# Altium schematic sheet LO 2.SchDoc
size A4; SheetNumber: 9; SheetTotal: 12
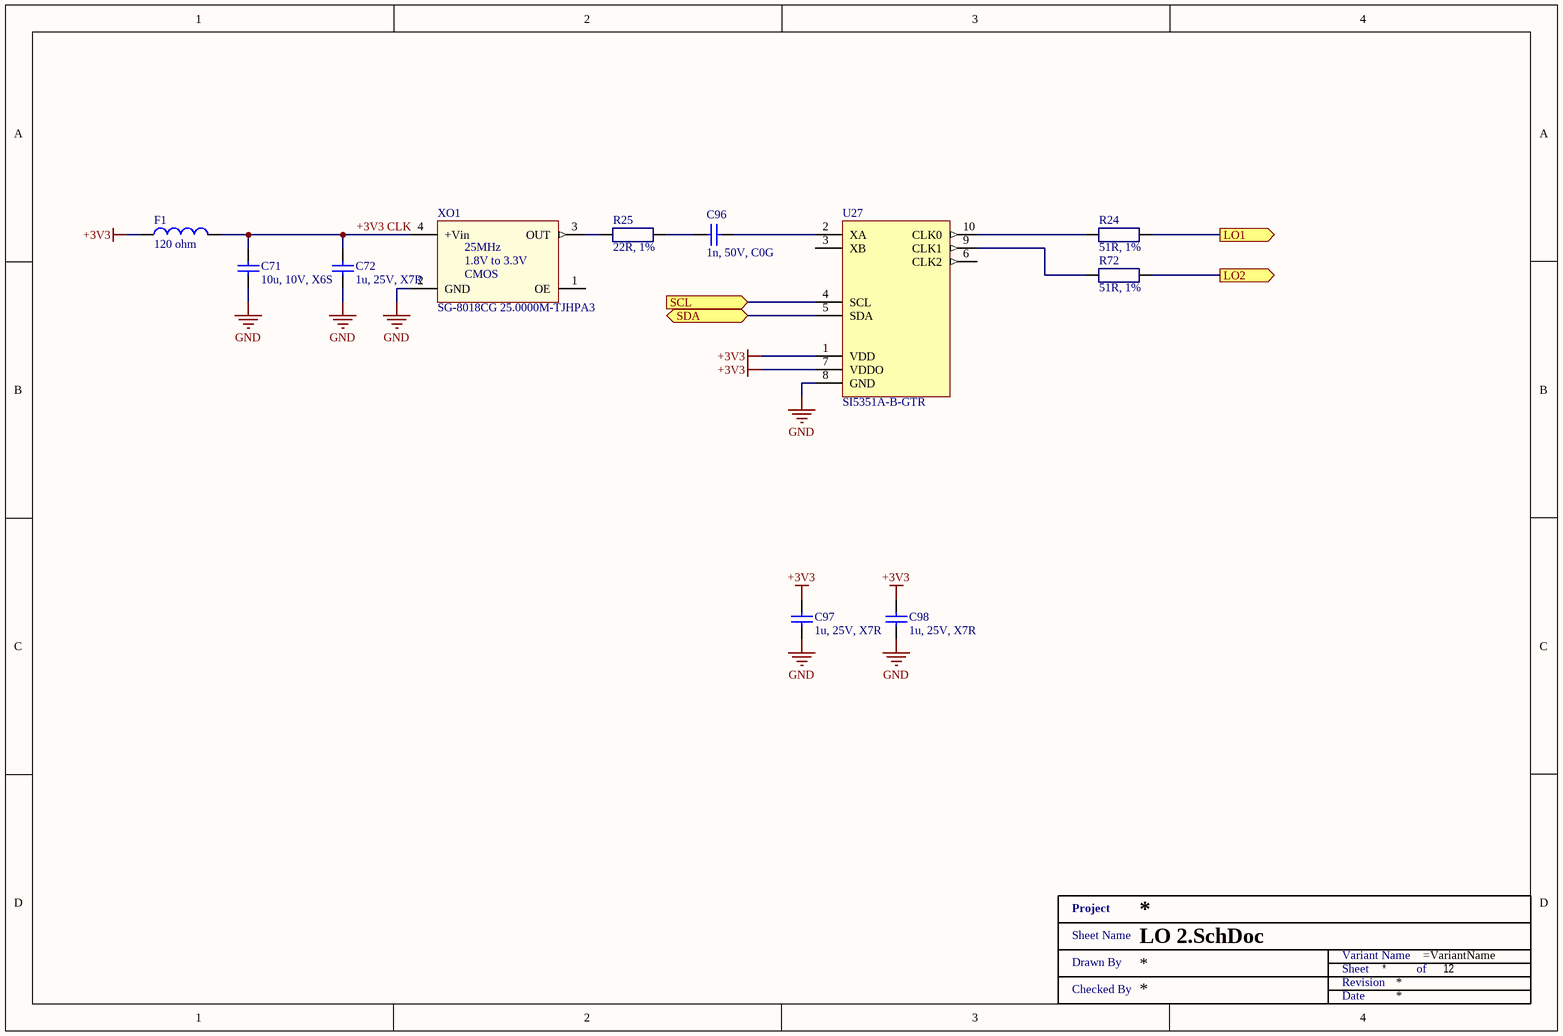
[diagram p0: LO 2.SchDoc]

## Parts
C71  10u, 10V, X6S  [SMD0603]
C72  1u, 25V, X7R  [SMD0603]
C96  1n, 50V, C0G  [SMD0603]
C97  1u, 25V, X7R  [SMD0603]
C98  1u, 25V, X7R  [SMD0603]
F1  120 ohm  [SMD0805 - R]
R24  51R, 1%  [SMD0603 - R]
R25  22R, 1%  [SMD0603 - R]
R72  51R, 1%  [SMD0603 - R]
U27  SI5351A-B-GTR  [MSOP-10]
XO1  SG-8018CG 25.0000M-TJHPA3  [XO 2.5x2.0mm]
XX?  Title 1  (value not drawn)  (graphical)

## Ports
LO1 (out), LO2 (out), SCL (in), SDA (bidir)

## Nets
+3V3: C97.2 C98.2 F1.2 U27.1(VDD) U27.7(VDDO)
GND: C71.1 C72.1 C97.1 C98.1 U27.8(GND) XO1.2(GND)
+3V3 CLK: C71.2 C72.2 F1.1 XO1.4(+Vin)
LO1: R24.2 ; port LO1
LO2: R72.2 ; port LO2
SCL: U27.4(SCL) ; port SCL
SDA: U27.5(SDA) ; port SDA
NetC96_1: C96.1 R25.2
NetC96_2: C96.2 U27.2(XA)
NetR24_1: R24.1 U27.10(CLK0)
NetR25_1: R25.1 XO1.3(OUT)
NetR72_1: R72.1 U27.9(CLK1)

Not connected (* = marked no-connect by the designer): U27 3(XB) 6(CLK2); XO1 1(OE)

## Notes on the sheet
- (in symbol SG-8018CG 25.0000M-TJHPA3) 1.8V to 3.3V; CMOS
- (in symbol Title 1) Project; Sheet Name; Variant Name; Drawn By; Sheet; of; Revision; Checked By; Date

## Library data of the parts
C71 = GRT188C81A106ME13D: Cap Ceramic 10uF 10V X6S 20% Pad SMD 0603 105C Automotive T/R; Manufacturer: Murata; Supplier 1: Mouser; Supplier Part Number 1: 81-GRT188C81A106ME3D; Manufacturer Part Number: GRT188C81A106ME13D; RoHS: No; Category: Ceramic Capacitors; Stock 1: 1862; Pricing 1: 1=0.41000, 10=0.20100, 50=0.20100, 100=0.17200, 1000=0.10900, 10000=0.09700 (USD); Mount: Surface Mount; Case/Package: 0603; Case Code (Metric): 1608; Case Code (Imperial): 0603; Min Operating Temperature: -55°C; Max Operating Temperature: 105°C; Packaging: Tape and Reel; Capacitance: 10uF; Voltage Rating: 10V; Tolerance: 20%; Length: 0.063inch; Width: 0.031inch; Thickness: 0.035inch; Ratings: AEC-Q200; ComponentLink1URL: http://search.murata.co.jp/Ceramy/image/img/A01X/G101/ENG/GRT188C81A106ME13-01.pdf?src-supplier=Digi-Key; ComponentLink1Description: http://search.murata.co.jp/Ceramy/image/img/A01X/G101/ENG/GRT188C81A106ME13-01.pdf?src-supplier=Digi-Key; Supplier 2: Farnell; Supplier Part Number 2: 3582904; Supplier 3: Digi-Key; Supplier Part Number 3: 490-12283-6-ND
C72 C97 C98 = CGA3E1X7R1E105K080AC: CAP CER 1UF 25V X7R 0603; Manufacturer: TDK Corporation; Tolerance: ±10%; Manufacturer Part Number: CGA3E1X7R1E105K080AC; RoHS: RoHS Compliant; Category: Capacitors; Stock 1: 109509; Pricing 1: 1=0.2, 10=0.135, 100=0.0686, 500=0.04696, 1000=0.04154 (USD); Packaging: Cut Tape (CT); Part Status: Active; Voltage - Rated: 25V; Temperature Coefficient: X7R; Operating Temperature: -55°C ~ 125°C; Features: -; Ratings: AEC-Q200; Applications: Automotive; Failure Rate: -; Mounting Type: Surface Mount, MLCC; Package / Case: 0603 (1608 Metric); Size / Dimension: 0.063" L x 0.032" W (1.60mm x 0.80mm); Height - Seated (Max): -; Thickness (Max): 0.035" (0.90mm); Lead Spacing: -; Lead Style: -; ComponentLink1URL: https://product.tdk.com/info/en/catalog/datasheets/mlcc_automotive_general_en.pdf; ComponentLink1Description: https://product.tdk.com/info/en/catalog/datasheets/mlcc_automotive_general_en.pdf; Capacitance: 1u; Supplier Part Number 2: 2346962
  C72: Supplier 1: Mouser; Supplier Part Number 1: 810-CGA3E1X7R1E105K; Supplier 2: Farnell; Supplier 3: Digi-Key; Supplier Part Number 3: 445-6931-1-ND
  C97 C98: Supplier 1: Digi-Key; Supplier Part Number 1: 445-6931-1-ND; Supplier 2: Mouser; Supplier Part Number 3: 810-CGA3E1X7R1E105K
C96 = MCU0603C102JCT: MULTICOMP - MCU0603C102JCT - CAP, MLCC, C0G/NP0, 1NF, 50V, 0603; Ceramic Capacitor Case: 0603 [1608 Metric]; Voltage Rating: 50; Capacitance Tolerance: ± 5%; Product Range: MCU Series; SVHC: No SVHC (07-Jul-2017); Capacitance Tolerance +: 5%; Capacitor Terminals: SMD; External Depth: 0.8; External Length / Height: 1.6; No. of Pins: 2; Reel Quantity: 4000; Temperature Coefficient: 0ppm/°C ± 30; Voltage Rating V DC: 50V<!--FANDB--><div class="features-and-benefits-container"><div class="features-and-benefits-desc-container"><span class="features-and-benefits-container-desc">SMD Multilayer Ceramic Capacitor, 0603 [1608 Metric], 1000 pF, 50 V, ± 5%, C0G / NP0; Supplier 1: Farnell; Supplier Part Number 1: 9406131; Manufacturer: MULTICOMP; Manufacturer Part Number: MCU0603C102JCT; RoHS: YES; Stock 1: 25831; Pricing 1: 10=0.0164, 100=0.0133, 500=0.0095, 1000=0.0082, 2000=0.0065 (GBP); Capacitance: 1n; Dielectric Characteristic: C0G / NP0; Packaging: Cut Tape; Operating Temperature Min: -55; Operating Temperature Max: 125; Automotive Qualification Standard: -; MSL: -; Capacitance Tolerance ±: ± 5%; External Width: 0.8; Operating Temperature Range: -55°C to +125; Tape Width: 8; Tolerance +: 5%; Tolerance -: 5%; ComponentLink1URL: http://www.farnell.com/datasheets/1723231.pdf; ComponentLink1Description: http://www.farnell.com/datasheets/1723231.pdf
F1 = 742792023: WURTH ELEKTRONIK - 742792023 - FERRITE BEAD, 0.03OHM, 3A, 0805; Impedance @ 100MHz: 120; Ferrite Case Style: 0805 [2012 Metric]; DC Current Rating: 3; DC Resistance Max: 0.03; Impedance Tolerance: ± 25%; Ferrite Mounting: SMD; Resistance: 0.03ohm<!--FANDB--><div class="features-and-benefits-container"><div class="features-and-benefits-description"><span class="features-benefits-value">The 742792023 is a SMD EMI Suppression Ferrite Bead with 0805 case and reliable Ni-Sn electrodes. It can be put directly on the printed circuit board. It offers excellent anti-EMI properties and low DC resistance. Placed very close next to the interference source even with smallest size 0402, maximal impedance at 1000; Manufacturer: WURTH ELEKTRONIK; Manufacturer Part Number: 742792023; RoHS: YES; Stock 1: 4283; Pricing 1: 1=0,123, 50=0,112, 100=0,103, 500=0,0937, 1000=0,0877, 2000=0,0846 (GBP); Product Range: -; Automotive Qualification Standard: -; Packaging: Cut Tape; ComponentLink1URL: http://www.farnell.com/datasheets/1695980.pdf; ComponentLink1Description: http://www.farnell.com/datasheets/1695980.pdf; ComponentLink2URL: http://www.farnell.com/cad/1670054.zip; ComponentLink2Description: http://www.farnell.com/cad/1670054.zip; Supplier 1: Mouser; Supplier Part Number 1: 710-742792023; Supplier 2: Farnell; Supplier Part Number 2: 1635732; Supplier 3: Digi-Key; Supplier Part Number 3: 732-1613-1-ND
R24 R72 = CRCW060351R0FKEA: RES SMD 51 OHM 1% 1/10W 0603; Manufacturer: Vishay Dale; Power (Watts): 0.1W, 1/10W; Temperature Coefficient: ±100ppm/°C; Manufacturer Part Number: CRCW060351R0FKEA; RoHS: RoHS Compliant; Category: Resistors; Stock 1: 21691; Pricing 1: 1=0.1, 10=0.042, 100=0.017, 1000=0.00764, 2500=0.00663 (USD); Packaging: Cut Tape (CT); Part Status: Active; Tolerance: ±1%; Composition: Thick Film; Features: Automotive AEC-Q200; Operating Temperature: -55°C ~ 155°C; Package / Case: 0603 (1608 Metric); Supplier Device Package: 0603; Size / Dimension: 0.063" L x 0.033" W (1.60mm x 0.85mm); Height - Seated (Max): 0.020" (0.50mm); Failure Rate: -; ComponentLink1URL: http://www.vishay.com/docs/20035/dcrcwe3.pdf; ComponentLink1Description: http://www.vishay.com/docs/20035/dcrcwe3.pdf; Resistance: 51R; Supplier 1: Mouser; Supplier Part Number 1: 71-CRCW0603-51-E3; Supplier 2: Farnell; Supplier Part Number 2: 1652889; Supplier 3: Digi-Key; Supplier Part Number 3: 541-51.0HCT-ND
R25 = RC0603FR-0722RL: YAGEO (PHYCOMP) - RC0603FR-0722RL - RES, THICK FILM, 22R, 1%, 0.1W, 0603; Voltage Rating: 50; Resistor Case Style: 0603 [1608 Metric]; Power Rating: 100; Product Range: RC Series; Temperature Coefficient: ± 100; SVHC: No SVHC (20-Jun-2016); External Depth: 0.45; External Length / Height: 1.6; External Width: 0.8; Full Power Rating Temperature: 70; No. of Pins: 2; Reel Quantity: 5000; Resistor Mounting: Surface Mount Device; Voltage Rating V DC: 50V<!--FANDB--><div class="features-and-benefits-container"><div class="features-and-benefits-desc-container"><span class="features-and-benefits-container-desc">SMD Chip Resistor, Thick Film, 22 ohm, 50 V, 0603 [1608 Metric], 100 mW, ± 1%, RC Series</span></div><div class="features-and-benefits-description"><span class="features-benefits-value">The Yageo RC_L series resistors are general purpose thick film chip resistors with lead free terminations made by thick film process. The resistance range includes E24 and E96 decade values from 1ohm to 100Mohm. These resistors are constructed on top of a high grade ceramic body.</span></div><div class="features-and-benefits-list"><ul class="features-and-benefits-list-list"><li class="features-and-benefits-list-item">EIA 0075, 0100, 0201, 0402, 0603, 0805, 1206, 1210, 1218, 2010, 2512 case sizes available</li><li class="features-and-benefits-list-item">Small chip sizes save PCB space</li><li class="features-and-benefits-list-item">Rated voltage range of 10V to 200V</li><li class="features-and-benefits-list-item">Maximum power rating of 2W</li><li class="features-and-benefits-list-item">Available in ±0.1%, ±0.5%, ±1% and ±5% tolerance</li><li class="features-and-benefits-list-item">High component and equipment reliability</li><li class="features-and-benefits-list-item">Forbidden materials are not used in products/production</li><li class="features-and-benefits-list-item">-55°C to 155°C temperature range for RC0402 to RC2512 and -55°C to 125°C for RC0075 to RC0201; Manufacturer: YAGEO (PHYCOMP); Manufacturer Part Number: RC0603FR-0722RL; RoHS: YES; Stock 1: 33025; Pricing 1: 10=0.0102, 100=0.0068, 500=0.0051, 1000=0.0041, 2500=0.0034 (GBP); Resistance: 22R; Resistance Tolerance: ± 1%; Packaging: Cut Tape; Resistor Element Material: Thick Film; Automotive Qualification Standard: -; MSL: MSL 1 - Unlimited; Operating Temperature Max: 155; Operating Temperature Min: -55; Operating Temperature Range: -55°C to +155; Temperature Coeff. +: 100; Temperature Coeff. -: 100; Tolerance +: 1%; Tolerance -: 1%; ComponentLink1URL: http://www.farnell.com/datasheets/2167052.pdf; ComponentLink1Description: http://www.farnell.com/datasheets/2167052.pdf; ComponentLink2URL: http://www.farnell.com/cad/1555248.zip; ComponentLink2Description: http://www.farnell.com/cad/1555248.zip; Supplier 1: Mouser; Supplier Part Number 1: 603-RC0603FR-0722RL; Supplier 2: Farnell; Supplier Part Number 2: 9238280; Supplier 3: Digi-Key; Supplier Part Number 3: 311-22.0HRCT-ND
U27 = SI5351A-B-GTR: IC CLK GENERATOR 200MHZ 10MSOP; Manufacturer: Silicon Labs; Number of Outputs: 3; Max Duty Cycle: 55%; Operating Supply Current: 22mA; Number of Circuits: 2; Input: Crystal; PLL: Yes; Operating Supply Voltage: 3.3V; Supplier 1: Mouser; Supplier Part Number 1: 634-SI5351A-B-GTR; Manufacturer Part Number: SI5351A-B-GTR; RoHS: Yes; Category: Clock Generators, PLLs, Frequency Synthesizers; Mount: Surface Mount; Case/Package: MSOP; Number of Pins: 10; Min Operating Temperature: -40°C; Max Operating Temperature: 85°C; Packaging: Tape and Reel; Package Quantity: 2500; Max Frequency: 200MHz; Series: MultiSynth™; RoHS Compliant: Yes; ComponentLink1URL: http://www.mouser.com/ds/2/368/Si5351-B-346869.pdf?src-supplier=Mouser; ComponentLink1Description: http://www.mouser.com/ds/2/368/Si5351-B-346869.pdf?src-supplier=Mouser; ComponentLink2URL: https://www.silabs.com/Support%20Documents/TechnicalDocs/Si5350-51-short.pdf?src-supplier=Digi-Key; ComponentLink2Description: https://www.silabs.com/Support%20Documents/TechnicalDocs/Si5350-51-short.pdf?src-supplier=Digi-Key; ComponentLink3URL: https://www.silabs.com/documents/public/data-sheets/Si5351-B.pdf?src-supplier=Digi-Key; ComponentLink3Description: https://www.silabs.com/documents/public/data-sheets/Si5351-B.pdf?src-supplier=Digi-Key; ComponentLink4URL: https://www.silabs.com/Support%20Documents/TechnicalDocs/Si5351-B.pdf?src-supplier=Avnet; ComponentLink4Description: https://www.silabs.com/Support%20Documents/TechnicalDocs/Si5351-B.pdf?src-supplier=Avnet; ComponentLink5URL: https://www.silabs.com/Support%20Documents/TechnicalDocs/Si5351-B.pdf?src-supplier=Avnet+Asia; ComponentLink5Description: https://www.silabs.com/Support%20Documents/TechnicalDocs/Si5351-B.pdf?src-supplier=Avnet+Asia; Supplier 2: Farnell; Supplier Part Number 2: 3105964; Supplier 3: Digi-Key; Supplier Part Number 3: 336-3908-1-ND
XO1 = SG-8018CG 25.0000M-TJHPA3: Oscillator XO 25MHz ±50ppm 15pF CMOS 55% 1.8V/2.5V/3.3V 4-Pin SMD T/R; Manufacturer: Epson; Supplier 1: Mouser; Supplier Part Number 1: 732-CG25M-TJHPA3; Manufacturer Part Number: SG-8018CG 25.0000M-TJHPA3; Stock 1: 221; Pricing 1: 1=1,11000, 10=1,03000, 100=0,88700, 250=0,88700, 500=0,78900, 1000=0,72700 (USD); ComponentLink1URL: http://datasheet.octopart.com/SG-8018CG-25.0000M-TJHPA3-Epson-datasheet-137868109.pdf?src-supplier=Future+Electronics; ComponentLink1Description: http://datasheet.octopart.com/SG-8018CG-25.0000M-TJHPA3-Epson-datasheet-137868109.pdf?src-supplier=Future+Electronics; Supplier 2: Arrow; Supplier Part Number 2: SG-8018CG 25.0000M-TJHPA3; Supplier 3: Future Electronics; Supplier Part Number 3: SG-8018CG 25.0000M-TJHPA3-REEL; Freq: 25MHz